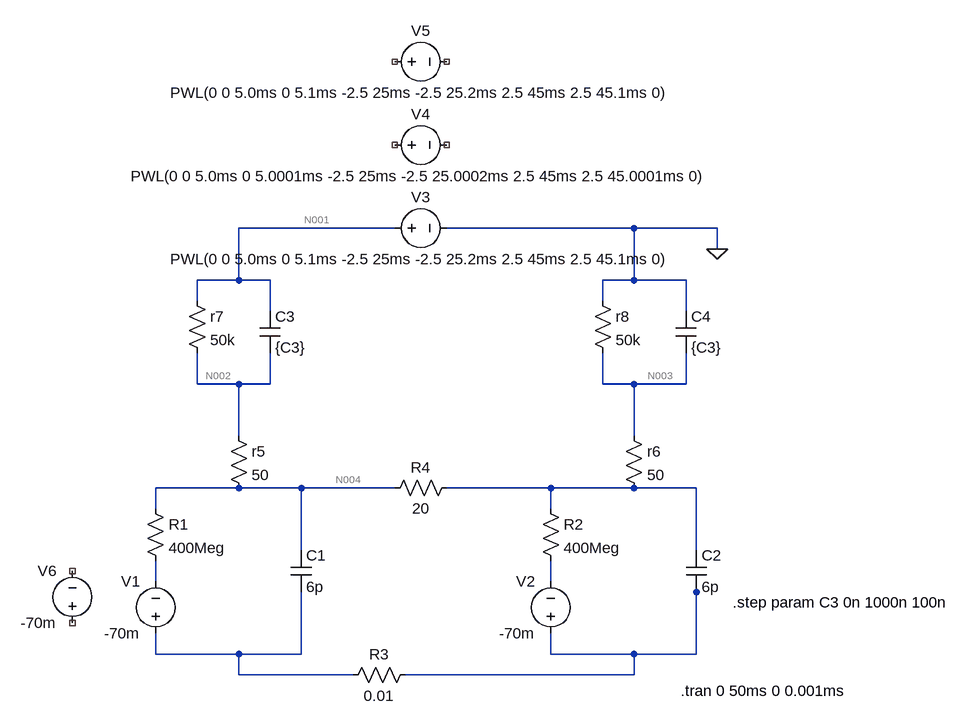
[diagram p0: schematic 電圧刺激等価回路_20210128_paramstep_cap.asc]
電圧刺激等価回路_20210128_paramstep_cap.asc, the LTspice schematic file:
Version 4
SHEET 1 1992 680
WIRE 368 -368 128 -368
WIRE 736 -368 448 -368
WIRE 864 -368 736 -368
WIRE 864 -336 864 -368
WIRE 128 -288 128 -368
WIRE 128 -288 64 -288
WIRE 176 -288 128 -288
WIRE 736 -288 736 -368
WIRE 736 -288 688 -288
WIRE 816 -288 736 -288
WIRE 64 -256 64 -288
WIRE 688 -256 688 -288
WIRE 176 -240 176 -288
WIRE 816 -240 816 -288
WIRE 64 -128 64 -176
WIRE 128 -128 64 -128
WIRE 176 -128 176 -176
WIRE 176 -128 128 -128
WIRE 688 -128 688 -176
WIRE 736 -128 688 -128
WIRE 816 -128 816 -176
WIRE 816 -128 736 -128
WIRE 128 -48 128 -128
WIRE 736 -48 736 -128
WIRE 128 32 0 32
WIRE 224 32 128 32
WIRE 368 32 224 32
WIRE 608 32 448 32
WIRE 736 32 608 32
WIRE 832 32 736 32
WIRE 0 64 0 32
WIRE 608 64 608 32
WIRE 224 128 224 32
WIRE 832 128 832 32
WIRE 0 176 0 144
WIRE 608 176 608 144
WIRE 832 192 832 176
WIRE 0 288 0 256
WIRE 128 288 0 288
WIRE 224 288 224 192
WIRE 224 288 128 288
WIRE 608 288 608 256
WIRE 736 288 608 288
WIRE 832 288 832 192
WIRE 832 288 736 288
WIRE 128 320 128 288
WIRE 304 320 128 320
WIRE 736 320 736 288
WIRE 736 320 384 320
FLAG 864 -336 0
SYMBOL res -16 48 R0
SYMATTR InstName R1
SYMATTR Value 400Meg
SYMBOL res 592 48 R0
SYMATTR InstName R2
SYMATTR Value 400Meg
SYMBOL res 400 304 R90
WINDOW 0 0 56 VBottom 2
WINDOW 3 32 56 VTop 2
SYMATTR InstName R3
SYMATTR Value 0.01
SYMBOL res 112 -64 R0
SYMATTR InstName r5
SYMATTR Value 50
SYMBOL res 720 -64 R0
SYMATTR InstName r6
SYMATTR Value 50
SYMBOL cap 208 128 R0
SYMATTR InstName C1
SYMATTR Value 6p
SYMBOL cap 816 128 R0
SYMATTR InstName C2
SYMATTR Value 6p
SYMBOL cap 160 -240 R0
SYMATTR InstName C3
SYMATTR Value {C3}
SYMBOL cap 800 -240 R0
SYMATTR InstName C4
SYMATTR Value {C3}
SYMBOL res 48 -272 R0
SYMATTR InstName r7
SYMATTR Value 50k
SYMBOL res 672 -272 R0
SYMATTR InstName r8
SYMATTR Value 50k
SYMBOL voltage 0 272 R180
WINDOW 0 24 96 Left 2
WINDOW 3 24 16 Left 2
SYMATTR InstName V1
SYMATTR Value -70m
SYMBOL voltage 608 272 R180
WINDOW 0 24 96 Left 2
WINDOW 3 24 16 Left 2
SYMATTR InstName V2
SYMATTR Value -70m
SYMBOL res 464 16 R90
WINDOW 0 0 56 VBottom 2
WINDOW 3 32 56 VTop 2
SYMATTR InstName R4
SYMATTR Value 20
SYMBOL voltage 352 -624 R270
WINDOW 0 32 56 VTop 2
WINDOW 3 -32 56 VBottom 2
WINDOW 123 0 0 Left 0
WINDOW 39 0 0 Left 0
SYMATTR InstName V5
SYMATTR Value PWL(0 0 5.0ms 0 5.1ms -2.5 25ms -2.5 25.2ms 2.5 45ms 2.5 45.1ms 0)
SYMBOL voltage 352 -496 R270
WINDOW 0 32 56 VTop 2
WINDOW 3 -32 56 VBottom 2
WINDOW 123 0 0 Left 0
WINDOW 39 0 0 Left 0
SYMATTR InstName V4
SYMATTR Value PWL(0 0 5.0ms 0 5.0001ms -2.5 25ms -2.5 25.0002ms 2.5 45ms 2.5 45.0001ms 0)
SYMBOL voltage 352 -368 R270
WINDOW 0 32 56 VTop 2
WINDOW 3 -32 56 VBottom 2
WINDOW 123 0 0 Left 0
WINDOW 39 0 0 Left 0
SYMATTR InstName V3
SYMATTR Value PWL(0 0 5.0ms 0 5.1ms -2.5 25ms -2.5 25.2ms 2.5 45ms 2.5 45.1ms 0)
SYMBOL voltage -128 256 R180
WINDOW 0 24 96 Left 2
WINDOW 3 24 16 Left 2
SYMATTR InstName V6
SYMATTR Value -70m
TEXT 808 344 Left 2 !.tran 0 50ms 0 0.001ms
TEXT 888 208 Left 2 !.step param C3 0n 1000n 100n

The netlist it stands for:
* 電圧刺激等価回路_20210128_paramstep_cap.asc
R1 N004 N006 400Meg
R2 N005 N007 400Meg
R3 N008 N009 0.01
r5 N002 N004 50
r6 N003 N005 50
C1 N004 N009 6p
C2 N005 N008 6p
C3 N001 N002 {C3}
C4 0 N003 {C3}
r7 N001 N002 50k
r8 0 N003 50k
V1 N009 N006 -70m
V2 N008 N007 -70m
R4 N005 N004 20
V5 NC_01 NC_02 PWL(0 0 5.0ms 0 5.1ms -2.5 25ms -2.5 25.2ms 2.5 45ms 2.5 45.1ms 0)
V4 NC_03 NC_04 PWL(0 0 5.0ms 0 5.0001ms -2.5 25ms -2.5 25.0002ms 2.5 45ms 2.5 45.0001ms 0)
V3 N001 0 PWL(0 0 5.0ms 0 5.1ms -2.5 25ms -2.5 25.2ms 2.5 45ms 2.5 45.1ms 0)
V6 NC_05 NC_06 -70m
.tran 0 50ms 0 0.001ms
.step param C3 0n 1000n 100n
.backanno
.end

* Results of the author's LTspice run, read from the files saved beside the schematic
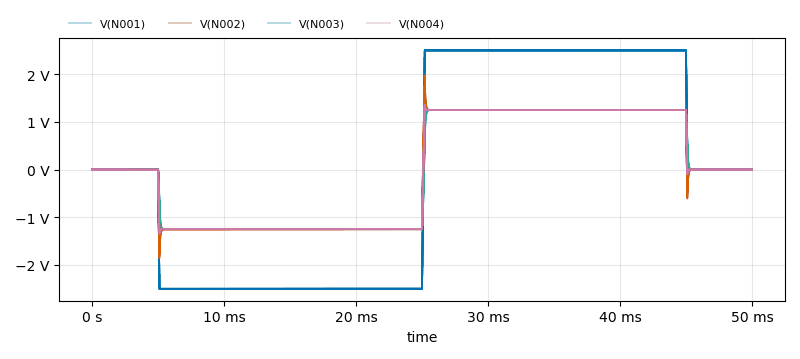
[diagram p1: Transient Analysis of 電圧刺激等価回路_20210128_paramstep_cap.asc, plotted from the saved traces]
* Transient Analysis, 11 runs:
*   V(N001) [c3=0]: min -2.5 V, max 2.5 V, average -5 mV, rms 2.236 V, last 0 V
*   V(N001) [c3=1e-007]: min -2.5 V, max 2.5 V, average -5 mV, rms 2.232 V, last 0 V
*   V(N001) [c3=2e-007]: min -2.5 V, max 2.5 V, average -5 mV, rms 2.232 V, last 0 V
*   V(N001) [c3=3e-007]: min -2.5 V, max 2.5 V, average -5 mV, rms 2.232 V, last 0 V
*   V(N001) [c3=4e-007]: min -2.5 V, max 2.5 V, average -5 mV, rms 2.231 V, last 0 V
*   V(N001) [c3=5e-007]: min -2.5 V, max 2.5 V, average -5 mV, rms 2.231 V, last 0 V
*   V(N001) [c3=6e-007]: min -2.5 V, max 2.5 V, average -5 mV, rms 2.231 V, last 0 V
*   V(N001) [c3=7e-007]: min -2.5 V, max 2.5 V, average -5 mV, rms 2.231 V, last 0 V
*   V(N002) [c3=0]: min -1.251 V, max 1.251 V, average -2.503 mV, rms 1.119 V, last 0 V
*   V(N002) [c3=1e-007]: min -1.326 V, max 1.326 V, average -2.503 mV, rms 1.117 V, last 0 V
*   V(N002) [c3=2e-007]: min -1.401 V, max 1.401 V, average -2.503 mV, rms 1.117 V, last 0 V
*   V(N002) [c3=3e-007]: min -1.475 V, max 1.476 V, average -2.503 mV, rms 1.118 V, last 0 V
*   V(N002) [c3=4e-007]: min -1.546 V, max 1.551 V, average -2.503 mV, rms 1.118 V, last 0 V
*   V(N002) [c3=5e-007]: min -1.612 V, max 1.625 V, average -2.503 mV, rms 1.118 V, last 0 V
*   V(N002) [c3=6e-007]: min -1.673 V, max 1.699 V, average -2.503 mV, rms 1.119 V, last 0 V
*   V(N002) [c3=7e-007]: min -1.727 V, max 1.771 V, average -2.503 mV, rms 1.119 V, last 0 V
*   V(N003) [c3=0]: min -1.249 V, max 1.249 V, average -2.497 mV, rms 1.117 V, last 0 V
*   V(N003) [c3=1e-007]: min -1.249 V, max 1.249 V, average -2.497 mV, rms 1.115 V, last 0 V
*   V(N003) [c3=2e-007]: min -1.249 V, max 1.249 V, average -2.497 mV, rms 1.114 V, last 0 V
*   V(N003) [c3=3e-007]: min -1.249 V, max 1.249 V, average -2.497 mV, rms 1.114 V, last 0 V
*   V(N003) [c3=4e-007]: min -1.249 V, max 1.249 V, average -2.497 mV, rms 1.114 V, last 0 V
*   V(N003) [c3=5e-007]: min -1.249 V, max 1.249 V, average -2.497 mV, rms 1.114 V, last 0 V
*   V(N003) [c3=6e-007]: min -1.249 V, max 1.249 V, average -2.497 mV, rms 1.114 V, last 0 V
*   V(N003) [c3=7e-007]: min -1.249 V, max 1.249 V, average -2.497 mV, rms 1.114 V, last 0 V
*   V(N004) [c3=0]: min -1.25 V, max 1.25 V, average -2.5 mV, rms 1.118 V, last 0 V
*   V(N004) [c3=1e-007]: min -1.263 V, max 1.263 V, average -2.5 mV, rms 1.116 V, last 0 V
*   V(N004) [c3=2e-007]: min -1.275 V, max 1.275 V, average -2.5 mV, rms 1.116 V, last 0 V
*   V(N004) [c3=3e-007]: min -1.288 V, max 1.288 V, average -2.5 mV, rms 1.116 V, last 0 V
*   V(N004) [c3=4e-007]: min -1.299 V, max 1.3 V, average -2.5 mV, rms 1.116 V, last 0 V
*   V(N004) [c3=5e-007]: min -1.31 V, max 1.313 V, average -2.501 mV, rms 1.116 V, last 0 V
*   V(N004) [c3=6e-007]: min -1.32 V, max 1.325 V, average -2.501 mV, rms 1.116 V, last 0 V
*   V(N004) [c3=7e-007]: min -1.329 V, max 1.337 V, average -2.501 mV, rms 1.116 V, last 0 V